# Altium schematic sheet DRV8428RTER1_DRV8428RTER.schdoc
size 127 x 101 mm
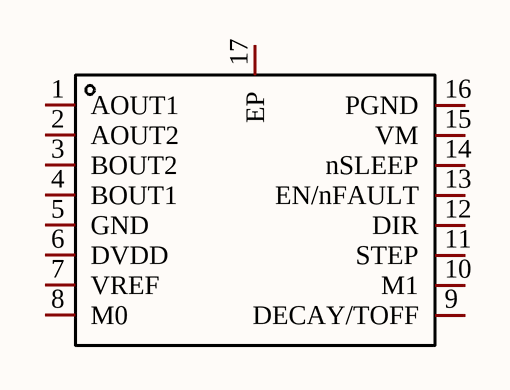
[diagram p0: DRV8428RTER1_DRV8428RTER.schdoc]

## Parts
U?  DRV8428RTER  [WQFN-16_L3.0-W3.0-P0.50-BL-EP1.7]  (value not drawn)

## Nets

Not connected (* = marked no-connect by the designer): U? 1(AOUT1) 2(AOUT2) 3(BOUT2) 4(BOUT1) 5(GND) 6(DVDD) 7(VREF) 8(M0) 9(DECAY/TOFF) 10(M1) 11(STEP) 12(DIR) 13(EN/nFAULT) 14(nSLEEP) 15(VM) 16(PGND) 17(EP)

## Library data of the parts
U? = DRV8428RTER: Manufacturer: TI(德州仪器); Add into BOM: yes; Symbol: DRV8428RTER; Device: DRV8428RTER; LCSC Part Name: DRV8428RTER; Supplier Part: C2857955; Manufacturer Part: DRV8428RTER; Supplier Footprint: WQFN-16-EP(3x3); JLCPCB Part Class: Extended Part; Datasheet: https://www.ti.com/cn/lit/gpn/drv8428; Supplier: LCSC; Convert to PCB: yes